# Altium schematic sheet Door_Receiver.SchDoc
size B; SheetNumber: 2; SheetTotal: 2
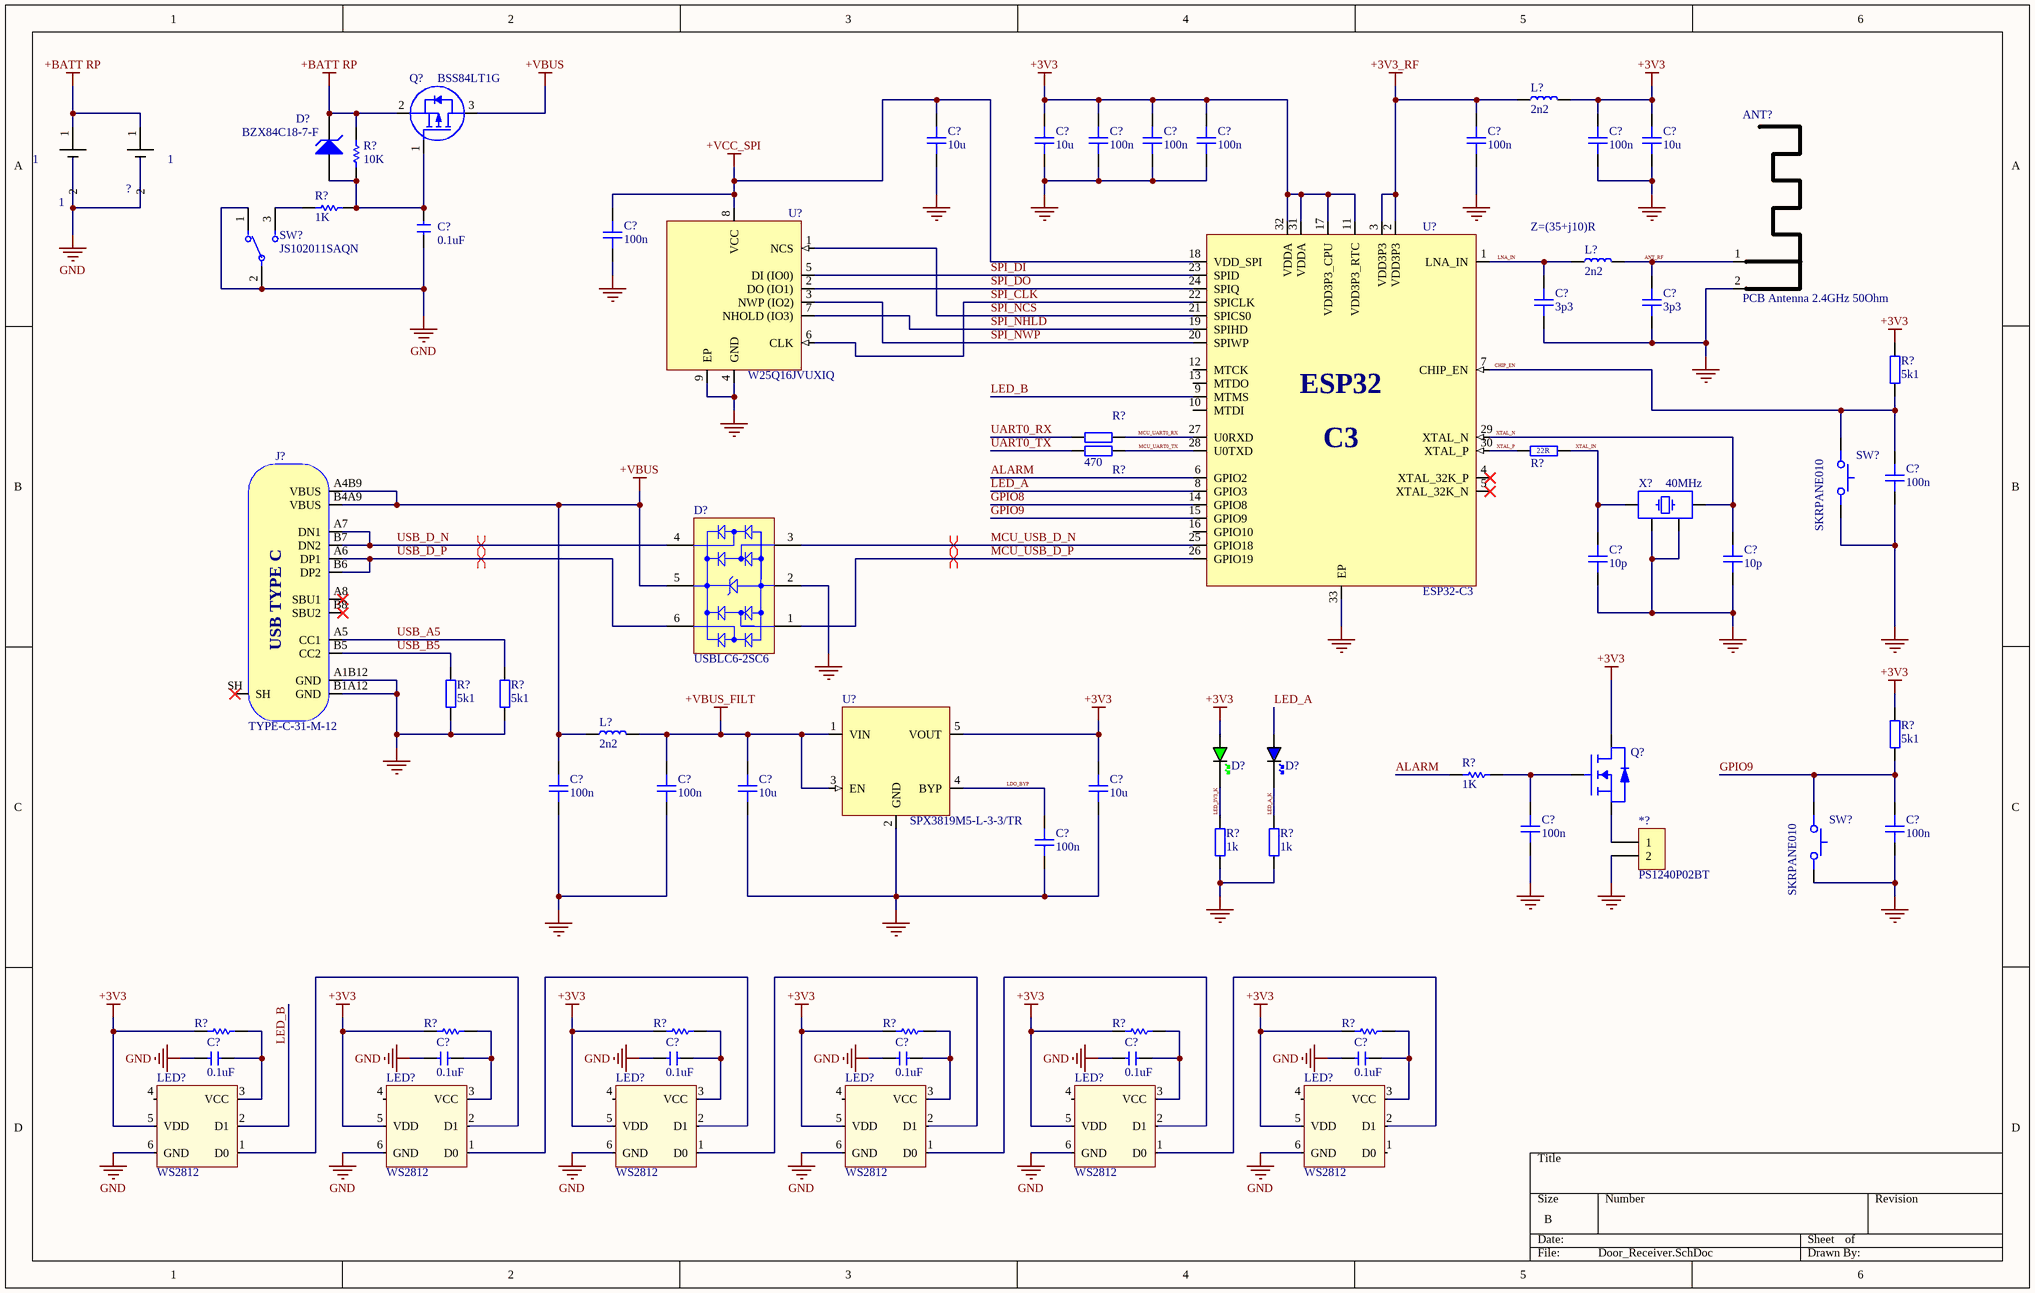
[diagram p0: Door_Receiver.SchDoc]

## Parts
(Parts that share a designator on the sheet are numbered #1, #2 ... from top to bottom, then left to right.)
1  1  [X001KMQ2V9]
*?  PS1240P02BT  [PS1240P02BT]
?  1  [X001KMQ2V9]
ANT?  PCB Antenna 2.4GHz 50Ohm  [ANT_IFA_USB_2_4GHZ_50R]  (no BOM)
C?#1  10u  [CAP_0603]
C?#2  10u  [CAP_0603]
C?#3  100n  [CAP_0805]
C?#4  100n  [CAP_0805]
C?#5  100n  [CAP_0805]
C?#6  100n  [CAP_0805]
C?#7  100n  [CAP_0805]
C?#8  10u  [CAP_0603]
C?#9  100n  [CAP_0805]
C?#10  0.1uF  [CAPC2012N]
C?#11  3p3  [CAP_0402]
C?#12  3p3  [CAP_0402]
C?#13  100n  [CAP_0805]
C?#14  10p  [CAP_0402]
C?#15  10p  [CAP_0402]
C?#16  100n  [CAP_0805]
C?#17  100n  [CAP_0805]
C?#18  10u  [CAP_0603]
C?#19  10u  [CAP_0603]
C?#20  100n  [CAP_0805]
C?#21  100n  [CAP_0805]
C?#22  100n  [CAP_0805]
C?#23  0.1uF  [CAPC2012N]
C?#24  0.1uF  [CAPC2012N]
C?#25  0.1uF  [CAPC2012N]
C?#26  0.1uF  [CAPC2012N]
C?#27  0.1uF  [CAPC2012N]
C?#28  0.1uF  [CAPC2012N]
D?#1  Manufacturer P/N: BZX84C18-7-F  [SOT23]  (hidden comment: Diode, Zener, BZX84C18)
D?#2  USBLC6-2SC6  [STM-SOT23-6L_V]
D?#3  GREEN  [LED_0603_GREEN]  (value not drawn)
D?#4  BLUE  [LED_0603_BLUE]  (value not drawn)
J?  TYPE-C-31-M-12  [TYPE-C-31-M-12]
L?#1  2n2  [IND_0402]
L?#2  2n2  [IND_0402]
L?#3  2n2  [IND_0402]
LED?#1  WS2812  [WS2812]
LED?#2  WS2812  [WS2812]
LED?#3  WS2812  [WS2812]
LED?#4  WS2812  [WS2812]
LED?#5  WS2812  [WS2812]
LED?#6  WS2812  [WS2812]
Q?#1  BSS84LT1G  [SOT23]
Q?#2  SSM3K72KCT,L3F  [CST3-SOT-883]  (value not drawn)
R?#1  10K  [RESC2012N]
R?#2  Resistance (Ohms): 1K  [RESC2012N]  (hidden comment: Res_1.0K_0805)
R?#3  5k1  [RES_0805]
R?#4  470  [RES_0805]  (value not drawn)
R?#5  470  [RES_0805]
R?#6  22R  [RES_0402]
R?#7  5k1  [RES_0805]
R?#8  5k1  [RES_0805]
R?#9  5k1  [RES_0805]
R?#10  Resistance (Ohms): 1K  [RESC2012N]  (hidden comment: Res_1.0K_0805)
R?#11  1k  [RES_0805]
R?#12  1k  [RES_0805]
R?#13  150  [RESC2012N]  (value not drawn)
R?#14  150  [RESC2012N]  (value not drawn)
R?#15  150  [RESC2012N]  (value not drawn)
R?#16  150  [RESC2012N]  (value not drawn)
R?#17  150  [RESC2012N]  (value not drawn)
R?#18  150  [RESC2012N]  (value not drawn)
SW?#1  JS102011SAQN  [FP-JS102011SAQN-MFG]
SW?#2  SKRPANE010  [SKRPANE010]
SW?#3  SKRPANE010  [SKRPANE010]
U?#1  W25Q16JVUXIQ  [USON-8-2X3MM]
U?#2  ESP32-C3  [QFN32-5x5]
U?#3  SPX3819M5-L-3-3/TR  [SOT-23-5]
X?  40MHz  [XTAL_2520]

## Nets
+3V3: C?#2.2 C?#3.2 C?#4.2 C?#5.2 C?#7.2 C?#8.2 C?#19.2 D?#3.A L?#1.1 LED?#1.5(VDD) LED?#2.5(VDD) LED?#3.5(VDD) LED?#4.5(VDD) LED?#5.5(VDD) LED?#6.5(VDD) Q?#2.D R?#3.2 R?#9.2 R?#13.1 R?#14.1 R?#15.1 R?#16.1 R?#17.1 R?#18.1 U?#2.11(VDD3P3_RTC) U?#2.17(VDD3P3_CPU) U?#2.31(VDDA) U?#2.32(VDDA) U?#3.5(VOUT)
+3V3_RF: C?#6.2 L?#1.2 U?#2.2(VDD3P3) U?#2.3(VDD3P3)
+BATT RP: 1.1 ?.1 D?#1.3(K) Q?#1.2 R?#1.2
+VBUS: C?#16.2 D?#2.5(VBUS) J?.A4B9(VBUS) J?.B4A9(VBUS) L?#3.2 Q?#1.3
+VBUS_FILT: C?#17.2 C?#18.2 L?#3.1 U?#3.1(VIN) U?#3.3(EN)
+VCC_SPI: C?#1.2 C?#9.2 U?#1.8(VCC) U?#2.18(VDD_SPI)
GND: 1.2 *?.2 ?.2 ANT?.2(GND) C?#1.1 C?#2.1 C?#3.1 C?#4.1 C?#5.1 C?#6.1 C?#7.1 C?#8.1 C?#9.1 C?#10.1 C?#11.1 C?#12.1 C?#13.1 C?#14.1 C?#15.1 C?#16.1 C?#17.1 C?#18.1 C?#19.1 C?#20.1 C?#21.1 C?#22.1 C?#23.1 C?#24.1 C?#25.1 C?#26.1 C?#27.1 C?#28.1 D?#2.2(GND) J?.A1B12(GND) J?.B1A12(GND) LED?#1.6(GND) LED?#2.6(GND) LED?#3.6(GND) LED?#4.6(GND) LED?#5.6(GND) LED?#6.6(GND) R?#7.1 R?#8.1 R?#11.1 R?#12.1 SW?#1.1 SW?#1.2(C) SW?#2.12 SW?#3.12 U?#1.4(GND) U?#1.9(EP) U?#2.33(EP) U?#3.2(GND) X?.2 X?.4
ALARM: R?#10.1 U?#2.6(GPIO2)
ANT_RF: ANT?.1(RF) C?#12.2 L?#2.1
CHIP_EN: C?#13.2 R?#3.1 SW?#2.34 U?#2.7(CHIP_EN)
GPIO8: U?#2.14(GPIO8)
GPIO9: C?#21.2 R?#9.1 SW?#3.34 U?#2.15(GPIO9)
LDO_BYP: C?#22.2 U?#3.4(BYP)
LED_3V3_K: D?#3.K R?#11.2
LED_A: D?#4.A U?#2.8(GPIO3)
LED_A_K: D?#4.K R?#12.2
LED_B: LED?#1.2(D1) U?#2.9(MTMS)
LNA_IN: C?#11.2 L?#2.2 U?#2.1(LNA_IN)
MCU_UART0_RX: R?#4.1 U?#2.27(U0RXD)
MCU_UART0_TX: R?#5.1 U?#2.28(U0TXD)
MCU_USB_D_N: D?#2.3(I/O_2) U?#2.25(GPIO18)
MCU_USB_D_P: D?#2.1(I/O_1) U?#2.26(GPIO19)
SPI_CLK: U?#1.6(CLK) U?#2.22(SPICLK)
SPI_DI: U?#1.5(DI_(IO0)) U?#2.23(SPID)
SPI_DO: U?#1.2(DO_(IO1)) U?#2.24(SPIQ)
SPI_NCS: U?#1.1(NCS) U?#2.21(SPICS0)
SPI_NHLD: U?#1.7(NHOLD_(IO3)) U?#2.19(SPIHD)
SPI_NWP: U?#1.3(NWP_(IO2)) U?#2.20(SPIWP)
UART0_RX: R?#4.2
UART0_TX: R?#5.2
USB_A5: J?.A5(CC1) R?#8.2
USB_B5: J?.B5(CC2) R?#7.2
USB_D_N: D?#2.4(I/O_3) J?.A7(DN1) J?.B7(DN2)
USB_D_P: D?#2.6(I/O_4) J?.A6(DP1) J?.B6(DP2)
XTAL_IN: C?#14.2 R?#6.2 X?.3
XTAL_N: C?#15.2 U?#2.29(XTAL_N) X?.1
XTAL_P: R?#6.1 U?#2.30(XTAL_P)
Net*?_1: *?.1 Q?#2.S
NetC?#10_2: C?#10.2 D?#1.1(A) Q?#1.1 R?#1.1 R?#2.2
NetC?#20_2: C?#20.2 Q?#2.G R?#10.2
NetC?#23_2: C?#23.2 LED?#1.3(VCC) R?#13.2
NetC?#24_2: C?#24.2 LED?#2.3(VCC) R?#14.2
NetC?#25_2: C?#25.2 LED?#3.3(VCC) R?#15.2
NetC?#26_2: C?#26.2 LED?#4.3(VCC) R?#16.2
NetC?#27_2: C?#27.2 LED?#5.3(VCC) R?#17.2
NetC?#28_2: C?#28.2 LED?#6.3(VCC) R?#18.2
NetLED?#1_1: LED?#1.1(D0) LED?#2.2(D1)
NetLED?#2_1: LED?#2.1(D0) LED?#3.2(D1)
NetLED?#3_1: LED?#3.1(D0) LED?#4.2(D1)
NetLED?#4_1: LED?#4.1(D0) LED?#5.2(D1)
NetLED?#5_1: LED?#5.1(D0) LED?#6.2(D1)
NetR?#2_1: R?#2.1 SW?#1.3

Not connected (* = marked no-connect by the designer): J? A8(SBU1)* B8(SBU2)* SH*; LED?#1 4(_); LED?#2 4(_); LED?#3 4(_); LED?#4 4(_); LED?#5 4(_); LED?#6 1(D0) 4(_); U?#2 4(XTAL_32K_P)* 5(XTAL_32K_N)* 10(MTDI) 12(MTCK) 13(MTDO) 16(GPIO10)

## Layout directives
differential pair; differential pair class DIFF_USB: MCU_USB_D_N, MCU_USB_D_P, USB_D_N, USB_D_P

## Notes on the sheet
- (near L?#2) Z=(35+j10)R
- (in symbol ESP32-C3) ESP32; C3
- (in symbol TYPE-C-31-M-12) USB TYPE C

## Library data of the parts
1 ? = X001KMQ2V9
*? = PS1240P02BT: Buzzer, Piezo, 3V, 12.2mm
ANT? = ANT_IFA_USB_2_4GHZ_50R: Inverted F 2.4GHz ISM PCB Antenna 50 Ohm; ComponentLink1Description: Datasheet; ComponentLink1URL: https://www.ti.com/lit/an/swra117d/swra117d.pdf
C?#1 C?#2 C?#8 C?#18 C?#19 = CAP_0603_10V: Capacitor SMD 0603 10V; Manufacturer: Samsung; Manufacturer Part Number: CL10A106KP8NNNC; LCSC: C19702
C?#3-C?#7 C?#9 C?#13 C?#16 C?#17 C?#20-C?#22 = CAP_0805_50V: Capacitor SMD 0805 50V
C?#10 C?#23-C?#28 = Cap_0.1uF_50V_0805: CAP CER 0.1UF 50V; Manufacturer: KEMET; Manufacturer P/N: C0805C104M5RACAUTO; Dielectric Material: Ceramic; Tolerance: 20%; Dielectric: X7R; Capacitance: 100nF; Supplier 1: Digi-Key; Supplier Part Number 1: 399-12977-1-ND; Mount: Surface Mount; Case/Package: 0805; Case Code (Metric): 2012; Case Code (Imperial): 0805; Contact Plating: Matte,Tin; Min Operating Temperature: -55°C; Max Operating Temperature: 125°C; Voltage Rating: 50V; Voltage Rating (DC): 50V; Termination: Wraparound; Length: 2mm; Width: 0.049inch; Thickness: 0.035inch; Depth: 1.25mm; Ratings: AEC-Q200; REACH SVHC: No SVHC
C?#11 C?#12 = CAP_0402_50V: Capacitor SMD 0402 50V; Manufacturer: FH; Manufacturer Part Number: 0402CG3R3C500NT; LCSC: C1565
C?#14 C?#15 = CAP_0402_50V: Capacitor SMD 0402 50V; Manufacturer: Samsung; Manufacturer Part Number: CL05C100JB5NNNC; LCSC: C32949
D?#1 = Diode_BZX84C18: DIODE ZENER 18V 300mW SOT23; Manufacturer: Diodes; Max Power Dissipation: 350mW; Max Reverse Leakage Current: 100nA; Tolerance: 6%; Zener Current: 5mA; Output Current: 18mA; Supplier 1: Digi-Key; Supplier Part Number 1: BZX84C18-FDICT-ND; Case/Package: SOT-23; Number of Pins: 3; Min Operating Temperature: -65°C; Max Operating Temperature: 150°C; Zener Voltage: 18V; Voltage Tolerance: 6%; Working Voltage: 18V; Peak Reverse Current: 100nA; Test Current: 5mA; Power Rating: 350mW; Voltage Rating (DC): 18V; Lead Free: Lead Free; ComponentLink1Description: https://www.diodes.com/assets/Datasheets/ds18001.pdf
D?#2 = CMP-2000-05378-1: Very low capacitance ESD protection, 3.5 pF, -40 to 125 degC, 6-Pin SOT23, RoHS, Tape and Reel; Manufacturer: STMicroelectronics; Polarity: Uni-Directional; Clamping Voltage: 17V; Rad Hardened: No; Product Height (mm): 1.3mm; Leakage Current (Max): 0.15uA; Product Length (mm): 3.05mm; Number of Elements: 1; Peak Pulse Current: 5A; Configuration: Dual; Reverse Breakdown Voltage: 6V; Working Voltage (Max): 5V; Capacitance Value: 3.5pF; Suppressor Type: DiodeArrays; Product Depth (mm): 1.75mm; Test Current (It): 1mA; Package / Case: SOT-23; Operating Temperature Max Deg. C: 125C; Package Description: 6-Pin Small Outline Transistor, Body 2.925 x 1.625 mm, Pitch 0.95 mm; Package Reference: SOT23-6L; Datasheet Version: Rev. 5, 10/2011; Operating Temperature Min Deg. C: -40C; Mounting Style: SurfaceMount; Direction Type: Uni-Directional; Mounting: SurfaceMount; Pin Count: 6; Leakage Current: 0.15uA; Packaging: TapeandReel; Operating Temperature Classification: Automotive; Clamping Voltage (Max): 17V; Manufacturer URL: http://www.st.com/; Reverse Stand-off Voltage: 5V; Datasheet URL: http://www.st.com/st-web-ui/static/active/en/resource/technical/document/datasheet/CD00050750.pdf; Working Voltage: 5V; Operating Temp Range: -40Cto125C; LCSC: C7519
D?#3 = LED_0603_GREEN: LED 0603 GREEN SMD; LCSC: C72043
D?#4 = LED_0603_BLUE: LED 0603 BLUE SMD
J? = TYPE-C-31-M-12: USB Type C Connector Horizontal SMT; Manufacturer: Koren Hroparts; Manufacturer Part Number: TYPE-C-31-M-12; LCSC: C165948
L?#1-L?#3 = IND_0402: Inductor SMD 0402; Manufacturer: Murata; Manufacturer Part Number: LQW15AN2N2G80D; LCSC: C412264
Q?#1 = BSS84LT1G: MOSFET P-CH 50V 130mA SOT-23; Manufacturer: ON Semiconductor; Manufacturer P/N: BSS84LT1-G; Rise Time: 1ns; Rds On Max: 10R; Input Capacitance: 30pF; Max Power Dissipation: 225mW; Turn-Off Delay Time: 16ns; Turn-On Delay Time: 3.6ns; Gate to Source Voltage (Vgs): 20V; Nominal Vgs: 2V; Threshold Voltage: -2V; Element Configuration: Single; Voltage Rating (DC): -50V; Current Rating: -130mA; Supplier 1: Digi-Key; Supplier Part Number 1: BSS84LT1GOSCT-ND; Case/Package: SOT-23-3; Number of Pins: 3; Contact Plating: Matte,Tin; Min Operating Temperature: -55°C; Max Operating Temperature: 150°C; Drain to Source Voltage (Vdss): 50V; Continuous Drain Current (ID): 130mA; Fall Time: 1ns; Power Dissipation: 225mW; Drain to Source Breakdown Voltage: 50V; Drain to Source Resistance: 10R; On-State Resistance: 10R; Radiation Hardening: No; Lead Free: Lead Free; REACH SVHC: No SVHC; Halogen Free: Halogen Free; ComponentLink3URL: http://www.onsemi.com/pub/Collateral/BSS84LT1-D.PDF; ComponentLink3Description: Datasheet
Q?#2 = SSM3K72KCT,L3F: MOSFET N-Channel Vds=60V Id=400mA Rds(on)=1.05R with ESD Protection; Manufacturer: Toshiba; Manufacturer Part Number: SSM3K72KCT,L3F; Distributor Link: https://www.mouser.de/ProductDetail/Toshiba/SSM3K72KCTL3F?qs=PDgMCp4xDJZBSQ%2Fqg29QOw%3D%3D
R?#1 = Res_10K_0805: RES 10K OHM 1/8W 1% 0805; Manufacturer: Vishay; Manufacturer P/N: CRCW080510K0FKEA; Resistance: 10kR; Power Rating: 125mW; Voltage Rating: 150V; Temperature Coefficient: 100ppm/°C; Supplier 1: Digi-Key; Supplier Part Number 1: 541-10.0KCCT-ND; Case/Package: 0805; Weight: 0.000194oz; Case Code (Imperial): 0805; Case Code (Metric): 2012; Contact Plating: Tin; Min Operating Temperature: -55°C; Max Operating Temperature: 155°C; Tolerance: 1%; Package Quantity: 5000; Composition: Thick Film; Military Standard: Not; Termination: SMD/SMT; Voltage Rating (DC): 150V; Length: 2mm; Height: 0.45mm; Width: 1.25mm; Depth: 1.25mm; Radiation Hardening: No; REACH SVHC: Unknown; Lead Free: Lead Free; ComponentLink4URL: http://www.vishay.com/docs/20035/dcrcwe3.pdf; ComponentLink4Description: http://www.vishay.com/docs/20035/dcrcwe3.pdf
R?#2 R?#10 = Res_1.0K_0805: RES 1.0K OHM 1/8W 1% 0805; Manufacturer P/N: RC0805FR-071KL; Manufacturer: Yageo; Power (Watts): 0.125W, 1/8W; Temperature Coefficient: ±100ppm/°C; Supplier 1: Digi-Key; Supplier Part Number 1: 311-1.00KCRCT-ND; RoHS: RoHS Compliant; Composition: Thick Film; Tolerance: ±1%; Package / Case: 0805 (2012 Metric); ComponentLink1URL: http://www.yageo.com/documents/recent/PYu-RC0805_51_RoHS_L_5.pdf; ComponentLink1Description: Datasheet; Supplier 2: Digi-Key; Supplier Part Number 2: 311-1.00KCRTR-ND
R?#3-R?#5 R?#7-R?#9 R?#11 R?#12 = RES_0805: Resistor SMD 0805; Manufacturer: *; Manufacturer Part Number: *; Distributor Link: *
R?#6 = RES_0402: Resistor SMD 0402; Manufacturer: UNI-ROYAL; Manufacturer Part Number: 0402WGF220JTCE; LCSC: C25092
R?#13-R?#18 = Res_150_0805: RES 150 OHM 1/8W 1% 0805; Manufacturer: Vishay; Manufacturer P/N: CRCW0805150RFKEA; Power Rating: 125mW; Resistance: 150R; Voltage Rating: 150V; Temperature Coefficient: 100ppm/°C; Supplier 1: Digi-Key; Supplier Part Number 1: 541-150CCT-ND; Mount: Surface Mount; Case/Package: 0805; Weight: 0.000194oz; Case Code (Metric): 2012; Case Code (Imperial): 0805; Contact Plating: Tin; Min Operating Temperature: -55°C; Max Operating Temperature: 155°C; Tolerance: 1%; Package Quantity: 10; Composition: Thick Film; Termination: SMD/SMT; Max Power Dissipation: 125mW; Voltage Rating (DC): 150V; Features: Automotive AEC-Q200; Military Standard: Not; Length: 2mm; Height: 0.45mm; Width: 0.049inch; Depth: 1.25mm; Radiation Hardening: No; Lead Free: Lead Free; REACH SVHC: Unknown; ComponentLink3URL: http://www.vishay.com/docs/20035/dcrcwe3.pdf; ComponentLink3Description: http://www.vishay.com/docs/20035/dcrcwe3.pdf
SW?#1 = CMP-2000-06501-2: SWITCH SLIDE SPDT 300MA 6V; Switch Function: On-On; Illumination Type: Non-Illuminated; Switch Travel: 2mm; Contact Resistance: 70mR; Actuator Material: Nylon; Electrical Life: 5000Cycles; Actuator Type: Standard; Max Operating Temperature: 85°C; Housing Material: Nylon; Radiation Hardening: No; Max Voltage Rating (DC): 6V; Package Quantity: 1; Case/Package: 100; Actuator Length: 2mm; Min Operating Temperature: -40°C; Contact Current Rating: 300mA; REACH SVHC: No SVHC; Throw Configuration: SPDT; Packaging: Tape and Reel; Contact Material: Copper Alloy; Max Current Rating: 300mA; Current Rating: 300mA; Mount: Surface Mount; Lead Free: Lead Free; Termination: Gull Wing; Voltage Rating (DC): 6V; Length: 9mm; Orientation: Right Angle; Contact Plating: Silver
SW?#2 SW?#3 = SKRPANE010: Tactile Switch SMD SPST; Manufacturer: Alps Alpine; Manufacturer Part Number: SKRPANE010; LCSC: C470426
U?#1 = W25Q16JVUXIQ: 16M-BIT SERIAL FLASH MEMORY WITH / DUAL/QUAD SPI USON-8; Manufacturer: Winbond; Manufacturer Part Number: W25Q16JVUXIQ; LCSC: C2843335
U?#2 = ESP32-C3: Ultra­Low­Power SoC with RISC­V Single­Core CPU Supporting IEEE 802.11b/g/n (2.4 GHz Wi­Fi) and Bluetooth® 5 (LE); Manufacturer: Espressif; Manufacturer Part Number: ESP32-C3; LCSC: C2838500
U?#3 = SPX3819M5-L-3-3/TR: 500mA +3.3V Low-Noise LDO Voltage Regulator; Manufacturer: MaxLinear; Manufacturer Part Number: SPX3819M5-L-3-3/TR; LCSC: C9055
X? = XTAL_2520: Crystal SMD 2520; Manufacturer: Seiko Epson; Manufacturer Number: Q24FA20H0020900; Frequency: 40MHz; LCSC: C255973